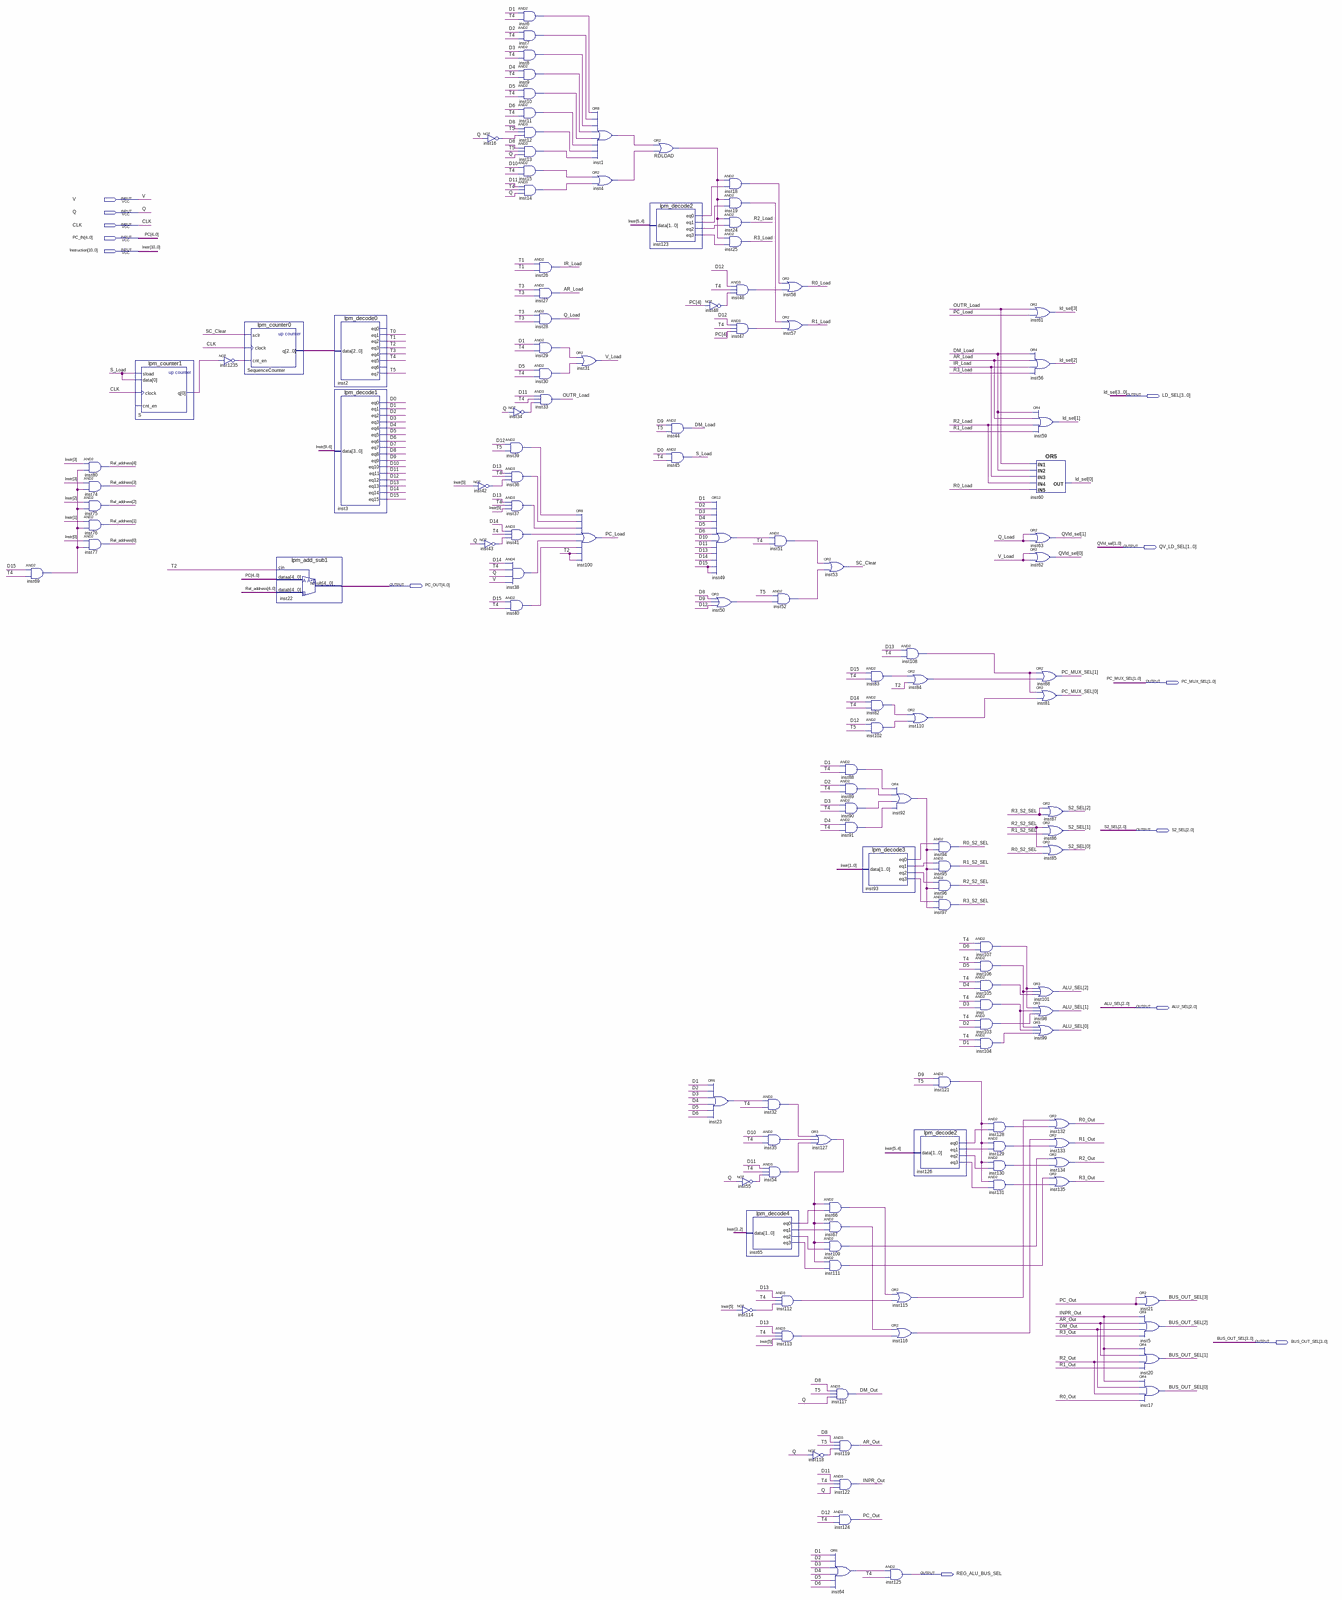
[diagram p0: schematic sheet, whole]
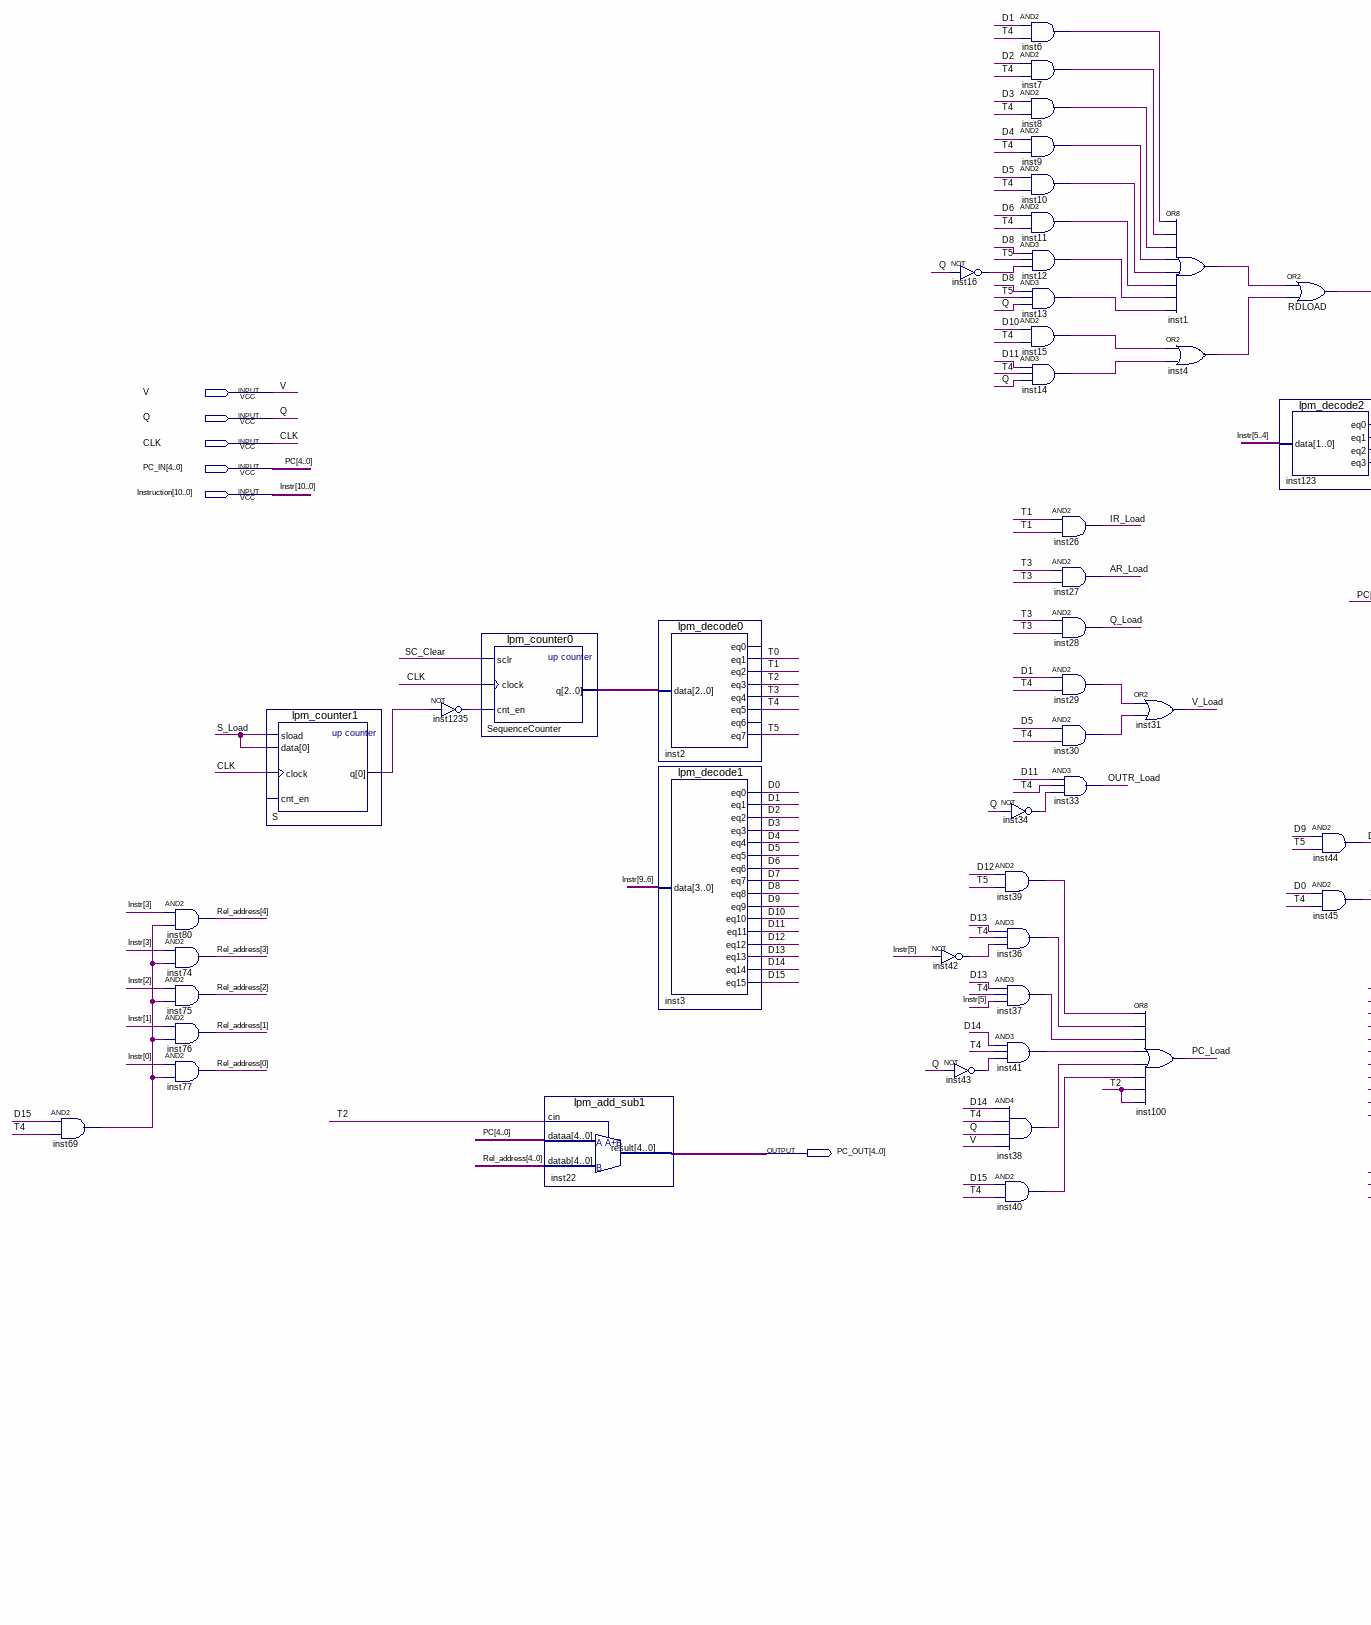
[diagram p1: schematic sheet, upper left part]
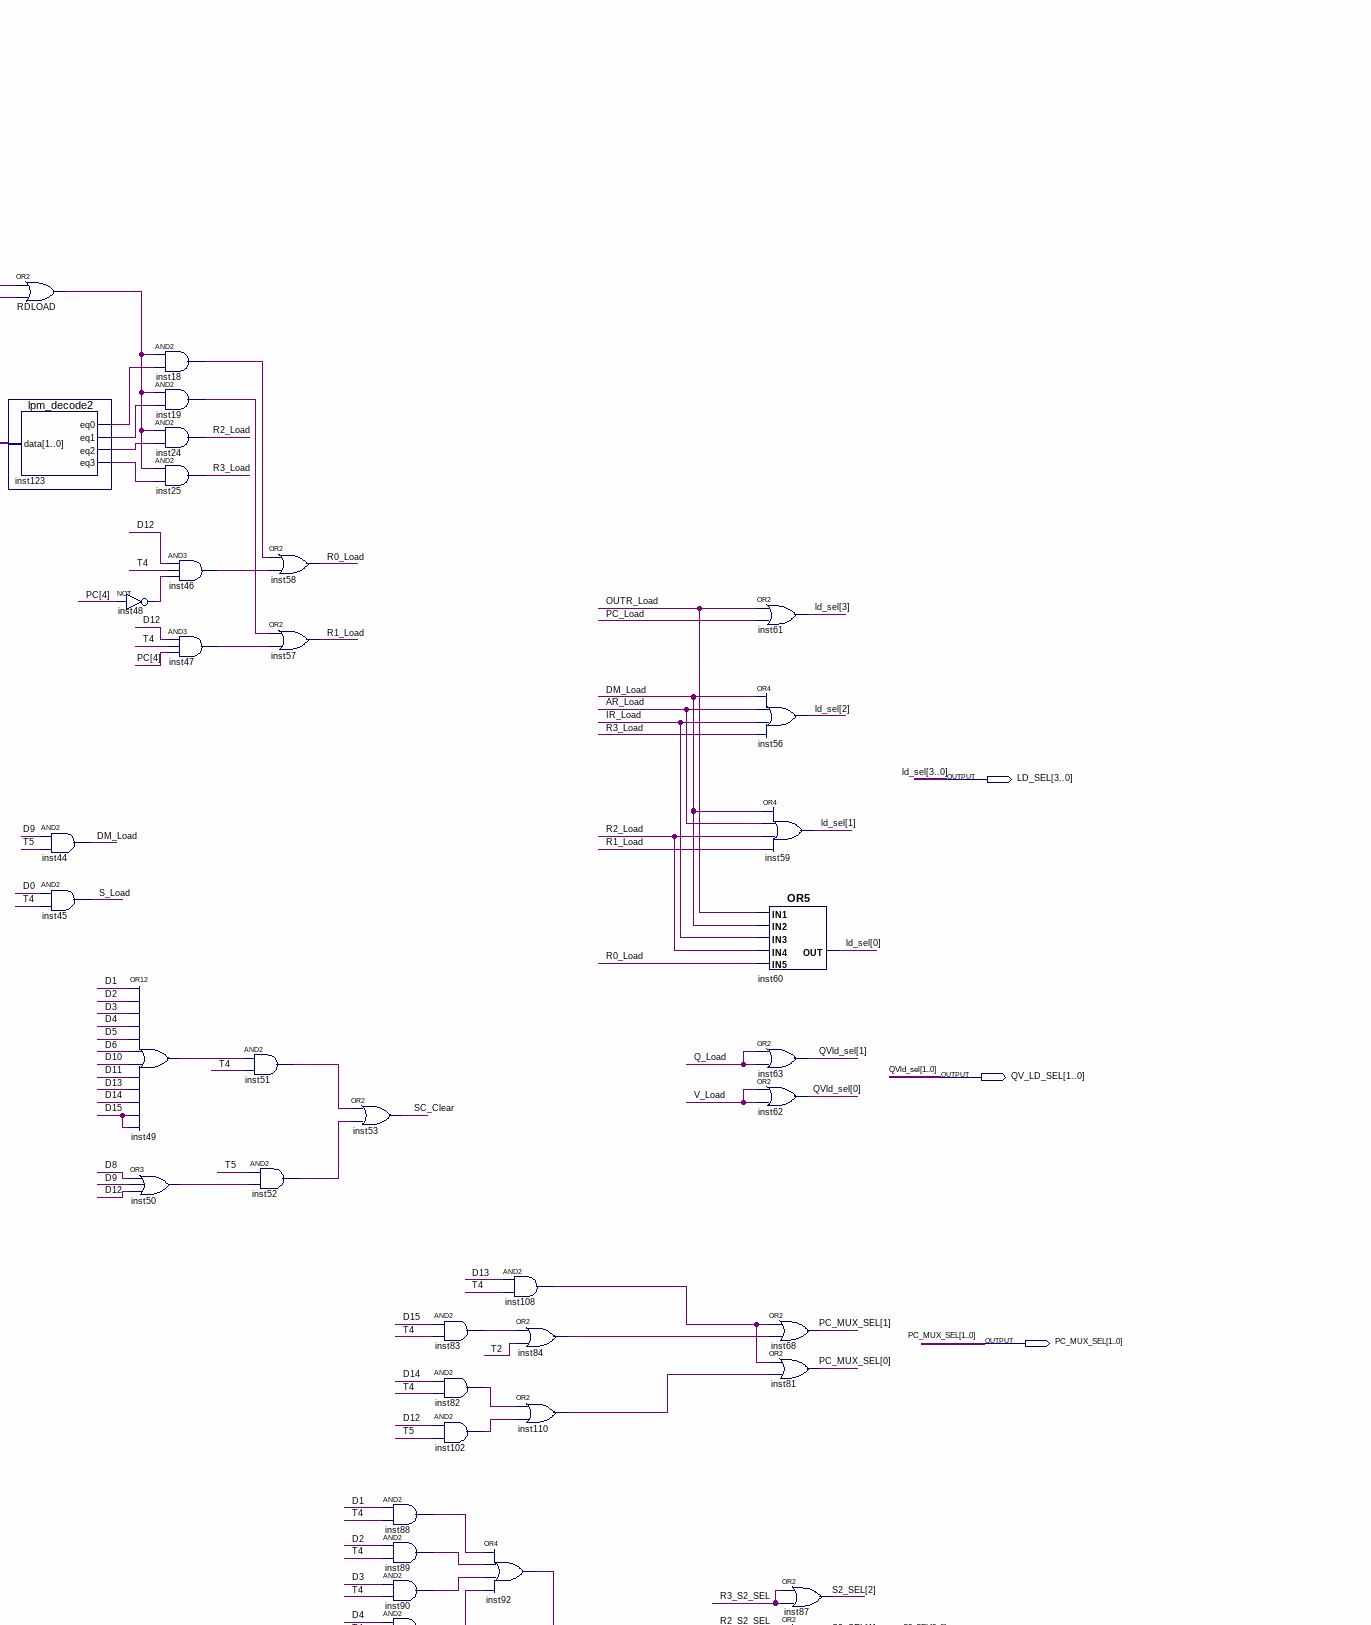
[diagram p2: schematic sheet, upper right part]
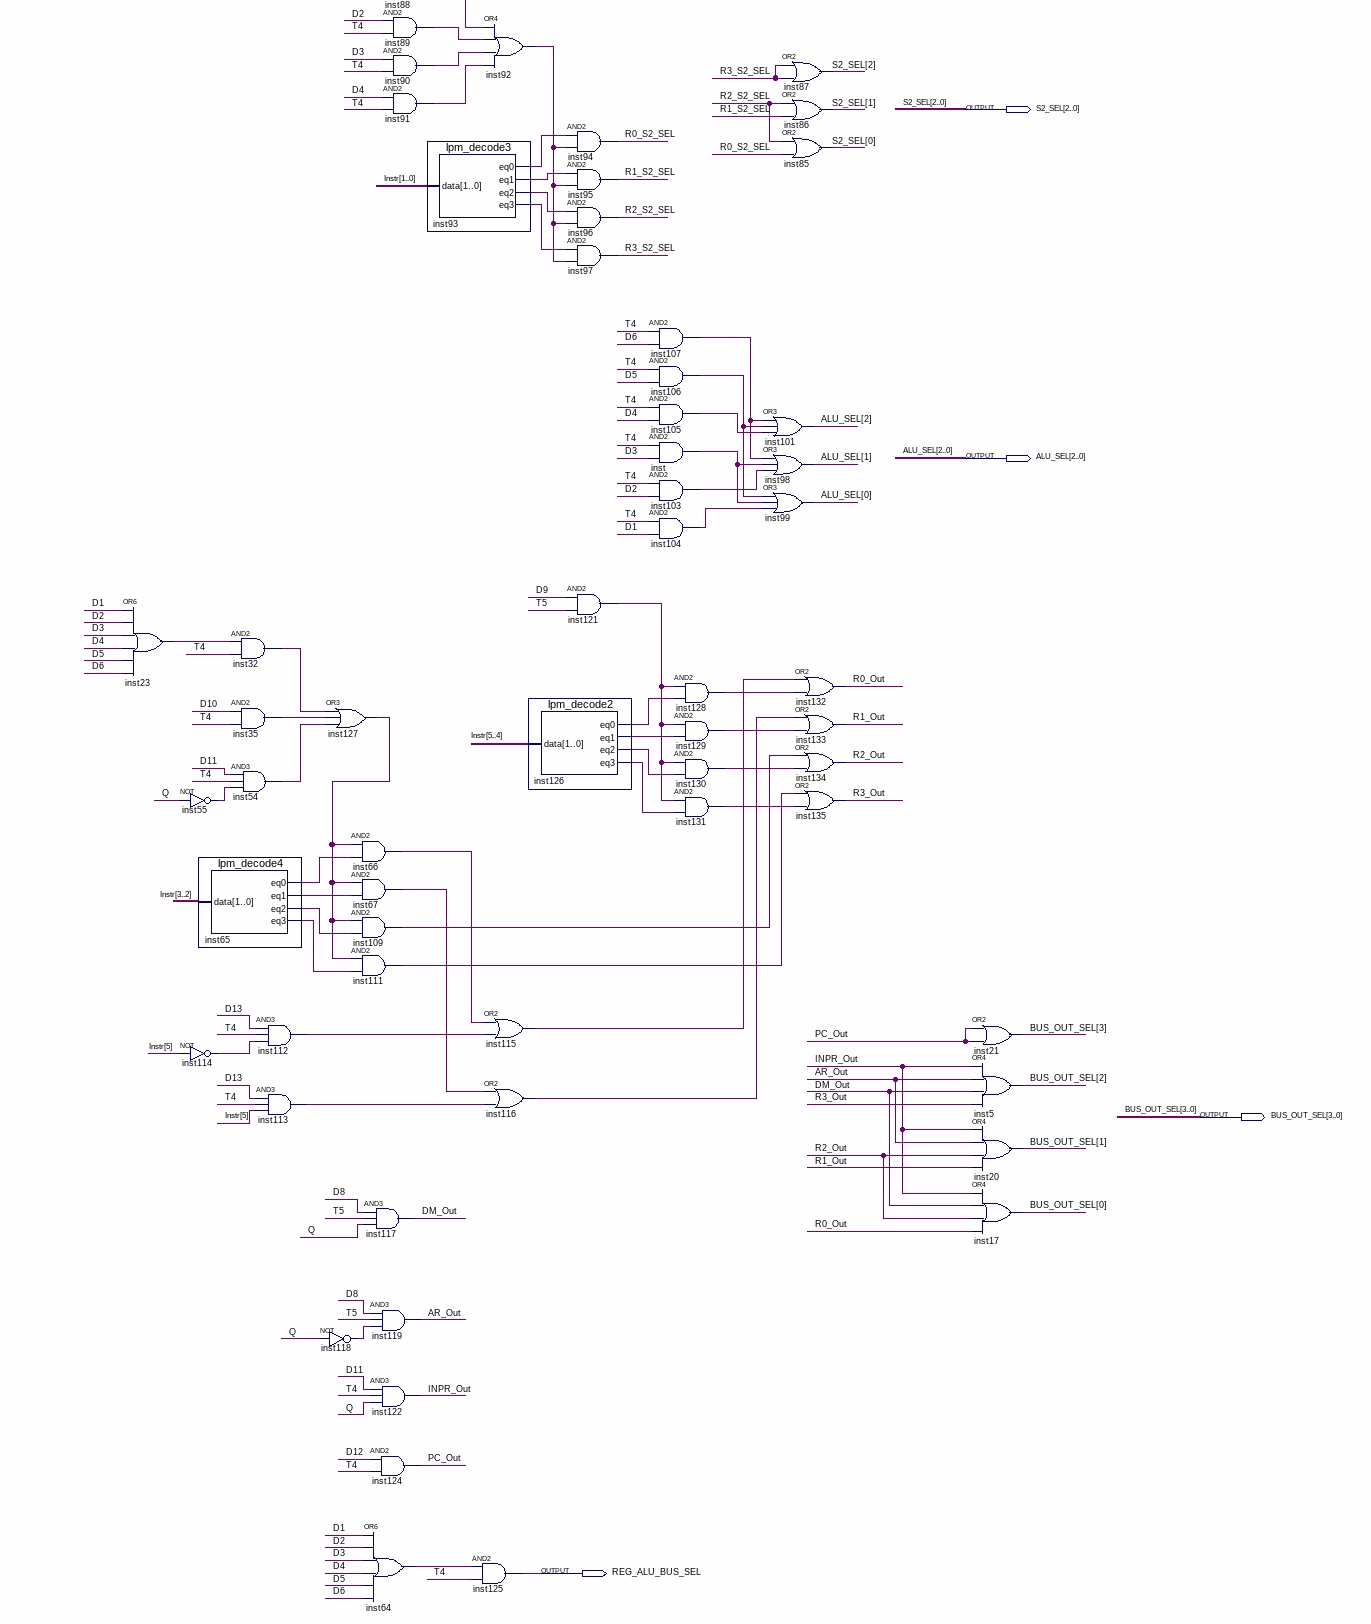
[diagram p3: schematic sheet, lower right part]
// Quartus schematic Control_Unit.bdf as structural Verilog: 133 symbols, 13 pins
module Control_Unit (
  input  V,
  input  Q,
  input  CLK,
  input  [4:0] PC_IN,
  input  [10:0] Instruction,
  output [3:0] LD_SEL,
  output [1:0] QV_LD_SEL,
  output [4:0] PC_OUT,
  output [1:0] PC_MUX_SEL,
  output [2:0] S2_SEL,
  output [2:0] ALU_SEL,
  output [3:0] BUS_OUT_SEL,
  output REG_ALU_BUS_SEL
);

  wire AR_Load, AR_Out, D0, D1, D2, D3, D4, D5, D6, D7, D8, D9, D10, D11, D12, D13, D14, D15, DM_Load,
       DM_Out, INPR_Out, inst1_out, inst4_out, inst6_out, inst7_out, inst8_out, inst9_out, inst10_out,
       inst11_out, inst12_out, inst13_out, inst14_out, inst15_out, inst16_out, inst18_out, inst19_out,
       inst23_out, inst29_out, inst30_out, inst32_out, inst34_out, inst35_out, inst36_out, inst37_out,
       inst38_out, inst39_out, inst40_out, inst41_out, inst42_out, inst43_out, inst46_out, inst47_out,
       inst48_out, inst49_out, inst50_out, inst51_out, inst52_out, inst54_out, inst55_out, inst64_out,
       inst65_eq0, inst65_eq1, inst65_eq2, inst65_eq3, inst66_out, inst67_out, inst69_out, inst82_out,
       inst83_out, inst84_out, inst88_out, inst89_out, inst90_out, inst91_out, inst92_out, inst93_eq0,
       inst93_eq1, inst93_eq2, inst93_eq3, inst102_out, inst103_out, inst104_out, inst105_out, inst106_out,
       inst107_out, inst108_out, inst109_out, inst110_out, inst111_out, inst112_out, inst113_out,
       inst114_out, inst115_out, inst116_out, inst118_out, inst121_out, inst123_eq0, inst123_eq1,
       inst123_eq2, inst123_eq3, inst126_eq0, inst126_eq1, inst126_eq2, inst126_eq3, inst127_out,
       inst128_out, inst129_out, inst130_out, inst131_out, inst1235_out, inst_out, IR_Load, OUTR_Load,
       PC_Load, PC_OUT_1bit, Q_Load, R0_Load, R0_Out, R0_S2_SEL, R1_Load, R1_Out, R1_S2_SEL, R2_Load, R2_Out,
       R2_S2_SEL, R3_Load, R3_Out, R3_S2_SEL, RDLOAD_out, S_Load, S_q, SC_Clear, T0, T1, T2, T3, T4, T5,
       V_Load;
  wire [2:0] SequenceCounter_q;
  wire [4:0] Rel_address;

  and inst69 (inst69_out, D15, T4);
  and inst80 (Rel_address[4], Instruction[3], inst69_out);
  and inst74 (Rel_address[3], Instruction[3], inst69_out);
  and inst75 (Rel_address[2], Instruction[2], inst69_out);
  and inst76 (Rel_address[1], Instruction[1], inst69_out);
  and inst77 (Rel_address[0], Instruction[0], inst69_out);
  lpm_counter1 S (.sload(S_Load), .data(S_Load), .clock(CLK), .q(S_q));  // open: cnt_en
  not inst1235 (inst1235_out, S_q);
  lpm_counter0 SequenceCounter (.sclr(SC_Clear), .clock(CLK), .cnt_en(inst1235_out), .q(SequenceCounter_q));
  lpm_add_sub1 inst22 (.cin(T2), .dataa(PC_IN), .datab(Rel_address), .result(PC_OUT));
  lpm_decode0 inst2 (
    .data(SequenceCounter_q), .eq1(T0), .eq2(T1), .eq3(T2), .eq4(T3), .eq5(T4), .eq7(T5));  // open: eq0, eq6
  lpm_decode1 inst3 (
    .data(Instruction[9:6]), .eq0(D0), .eq1(D1), .eq2(D2), .eq3(D3), .eq4(D4), .eq5(D5), .eq6(D6), .eq7(D7),
    .eq8(D8), .eq9(D9), .eq10(D10), .eq11(D11), .eq12(D12), .eq13(D13), .eq14(D14), .eq15(D15));
  not inst16 (inst16_out, Q);
  not inst42 (inst42_out, Instruction[5]);
  not inst43 (inst43_out, Q);
  not inst34 (inst34_out, Q);
  and inst39 (inst39_out, D12, T5);
  and inst36 (inst36_out, D13, T4, inst42_out);
  and inst37 (inst37_out, D13, T4, Instruction[5]);
  and inst41 (inst41_out, D14, T4, inst43_out);
  and inst38 (inst38_out, D14, T4, Q, V);
  and inst40 (inst40_out, D15, T4);
  and inst6 (inst6_out, D1, T4);
  and inst7 (inst7_out, D2, T4);
  and inst8 (inst8_out, D3, T4);
  and inst9 (inst9_out, D4, T4);
  and inst10 (inst10_out, D5, T4);
  and inst11 (inst11_out, D6, T4);
  and inst12 (inst12_out, D8, T5, inst16_out);
  and inst13 (inst13_out, D8, T5, Q);
  and inst15 (inst15_out, D10, T4);
  and inst14 (inst14_out, D11, T4, Q);
  and inst26 (IR_Load, T1, T1);
  and inst27 (AR_Load, T3, T3);
  and inst28 (Q_Load, T3, T3);
  and inst29 (inst29_out, D1, T4);
  and inst30 (inst30_out, D5, T4);
  and inst33 (OUTR_Load, D11, T4, inst34_out);
  or inst31 (V_Load, inst29_out, inst30_out);
  or inst100 (PC_Load, inst39_out, inst36_out, inst37_out, inst41_out, inst38_out, inst40_out, T2, T2);
  or inst1 (inst1_out, inst6_out, inst7_out, inst8_out, inst9_out, inst10_out, inst11_out, inst12_out, inst13_out);
  or inst4 (inst4_out, inst15_out, inst14_out);
  or RDLOAD (RDLOAD_out, inst1_out, inst4_out);
  lpm_decode2 inst123 (
    .data(Instruction[5:4]), .eq0(inst123_eq0), .eq1(inst123_eq1), .eq2(inst123_eq2), .eq3(inst123_eq3));
  and inst44 (DM_Load, D9, T5);
  and inst45 (S_Load, D0, T4);
  not inst48 (inst48_out, PC_IN[4]);
  or inst49 (inst49_out, D1, D2, D3, D4, D5, D6, D10, D11, D13, D14, D15, D15);
  or inst50 (inst50_out, D8, D9, D12);
  or inst23 (inst23_out, D1, D2, D3, D4, D5, D6);
  and inst18 (inst18_out, RDLOAD_out, inst123_eq0);
  and inst19 (inst19_out, RDLOAD_out, inst123_eq1);
  and inst24 (R2_Load, RDLOAD_out, inst123_eq2);
  and inst25 (R3_Load, RDLOAD_out, inst123_eq3);
  and inst46 (inst46_out, D12, T4, inst48_out);
  and inst47 (inst47_out, D12, T4, PC_IN[4]);
  not inst55 (inst55_out, Q);
  not inst114 (inst114_out, Instruction[5]);
  and inst51 (inst51_out, inst49_out, T4);
  and inst32 (inst32_out, inst23_out, T4);
  and inst35 (inst35_out, D10, T4);
  and inst54 (inst54_out, D11, T4, inst55_out);
  lpm_decode4 inst65 (.data(Instruction[3:2]), .eq0(inst65_eq0), .eq1(inst65_eq1), .eq2(inst65_eq2), .eq3(inst65_eq3));
  or inst58 (R0_Load, inst18_out, inst46_out);
  or inst57 (R1_Load, inst19_out, inst47_out);
  and inst52 (inst52_out, T5, inst50_out);
  and inst112 (inst112_out, D13, T4, inst114_out);
  and inst113 (inst113_out, D13, T4, Instruction[5]);
  or inst127 (inst127_out, inst32_out, inst35_out, inst54_out);
  not inst118 (inst118_out, Q);
  or inst53 (SC_Clear, inst51_out, inst52_out);
  and inst88 (inst88_out, D1, T4);
  and inst89 (inst89_out, D2, T4);
  and inst90 (inst90_out, D3, T4);
  and inst91 (inst91_out, D4, T4);
  and inst66 (inst66_out, inst127_out, inst65_eq0);
  and inst67 (inst67_out, inst127_out, inst65_eq1);
  and inst109 (inst109_out, inst127_out, inst65_eq2);
  and inst111 (inst111_out, inst127_out, inst65_eq3);
  and inst117 (DM_Out, D8, T5, Q);
  and inst119 (AR_Out, D8, T5, inst118_out);
  and inst122 (INPR_Out, D11, T4, Q);
  and inst124 (PC_OUT_1bit, D12, T4);
  or inst64 (inst64_out, D1, D2, D3, D4, D5, D6);
  and inst83 (inst83_out, D15, T4);
  and inst82 (inst82_out, D14, T4);
  and inst102 (inst102_out, D12, T5);
  lpm_decode3 inst93 (.data(Instruction[1:0]), .eq0(inst93_eq0), .eq1(inst93_eq1), .eq2(inst93_eq2), .eq3(inst93_eq3));
  or inst92 (inst92_out, inst88_out, inst89_out, inst90_out, inst91_out);
  or inst115 (inst115_out, inst66_out, inst112_out);
  or inst116 (inst116_out, inst67_out, inst113_out);
  and inst125 (REG_ALU_BUS_SEL, inst64_out, T4);
  and inst108 (inst108_out, D13, T4);
  or inst84 (inst84_out, inst83_out, T2);
  or inst110 (inst110_out, inst82_out, inst102_out);
  lpm_decode2 inst126 (
    .data(Instruction[5:4]), .eq0(inst126_eq0), .eq1(inst126_eq1), .eq2(inst126_eq2), .eq3(inst126_eq3));
  and inst94 (R0_S2_SEL, inst93_eq0, inst92_out);
  and inst95 (R1_S2_SEL, inst93_eq1, inst92_out);
  and inst96 (R2_S2_SEL, inst93_eq2, inst92_out);
  and inst97 (R3_S2_SEL, inst93_eq3, inst92_out);
  and inst121 (inst121_out, D9, T5);
  and inst107 (inst107_out, T4, D6);
  and inst106 (inst106_out, T4, D5);
  and inst105 (inst105_out, T4, D4);
  and inst (inst_out, T4, D3);
  and inst103 (inst103_out, T4, D2);
  and inst104 (inst104_out, T4, D1);
  and inst128 (inst128_out, inst121_out, inst126_eq0);
  and inst129 (inst129_out, inst121_out, inst126_eq1);
  and inst130 (inst130_out, inst121_out, inst126_eq2);
  and inst131 (inst131_out, inst121_out, inst126_eq3);
  or inst61 (LD_SEL[3], OUTR_Load, PC_Load);
  or inst56 (LD_SEL[2], DM_Load, AR_Load, IR_Load, R3_Load);
  or inst59 (LD_SEL[1], DM_Load, AR_Load, R2_Load, R1_Load);
  or inst60 (LD_SEL[0], OUTR_Load, DM_Load, IR_Load, R2_Load, R0_Load);
  or inst63 (QV_LD_SEL[1], Q_Load, Q_Load);
  or inst62 (QV_LD_SEL[0], V_Load, V_Load);
  or inst68 (PC_MUX_SEL[1], inst108_out, inst84_out);
  or inst81 (PC_MUX_SEL[0], inst108_out, inst110_out);
  or inst87 (S2_SEL[2], R3_S2_SEL, R3_S2_SEL);
  or inst86 (S2_SEL[1], R2_S2_SEL, R1_S2_SEL);
  or inst85 (S2_SEL[0], R2_S2_SEL, R0_S2_SEL);
  or inst101 (ALU_SEL[2], inst107_out, inst106_out, inst105_out);
  or inst98 (ALU_SEL[1], inst107_out, inst_out, inst103_out);
  or inst99 (ALU_SEL[0], inst106_out, inst_out, inst104_out);
  or inst132 (R0_Out, inst115_out, inst128_out);
  or inst133 (R1_Out, inst116_out, inst129_out);
  or inst134 (R2_Out, inst109_out, inst130_out);
  or inst135 (R3_Out, inst111_out, inst131_out);
  or inst21 (BUS_OUT_SEL[3], PC_OUT_1bit, PC_OUT_1bit);
  or inst5 (BUS_OUT_SEL[2], INPR_Out, AR_Out, DM_Out, R3_Out);
  or inst20 (BUS_OUT_SEL[1], INPR_Out, AR_Out, R2_Out, R1_Out);
  or inst17 (BUS_OUT_SEL[0], INPR_Out, DM_Out, R2_Out, R0_Out);

  // Other names for the same wires on the sheet: Instr[10:0] = Instruction; PC[4:0] = PC_IN;
  //   QVld_sel[1:0] = QV_LD_SEL
endmodule
